# EAGLE design switch (EAGLE 7.5.0)

## Sheet 1 of 2
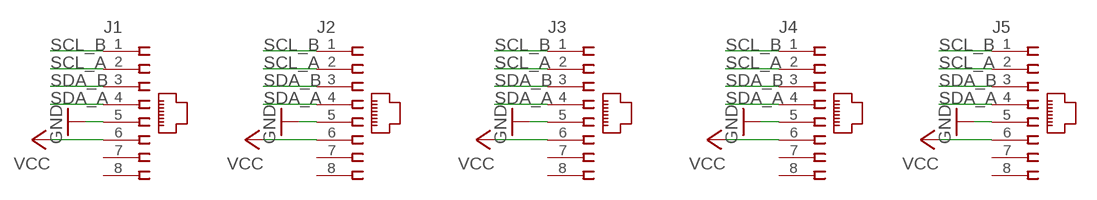
[diagram p0: schematic, sheet 1]

### Parts
J1  215877-4  [215877-4]
J2  215877-4  [215877-4]
J3  215877-4  [215877-4]
J4  215877-4  [215877-4]
J5  215877-4  [215877-4]

### Nets
GND: J1.5 J2.5 J3.5 J4.5 J5.5
SCL_A: J1.2 J2.2 J3.2 J4.2 J5.2
SCL_B: J1.1 J2.1 J3.1 J4.1 J5.1
SDA_A: J1.4 J2.4 J3.4 J4.4 J5.4
SDA_B: J1.3 J2.3 J3.3 J4.3 J5.3
VCC: J1.6 J2.6 J3.6 J4.6 J5.6
Unconnected: J1.7 J1.8 J2.7 J2.8 J3.7 J3.8 J4.7 J4.8 J5.7 J5.8

## Sheet 2 of 2

## Library data of the parts
J1-J5 = con-amp:215877-4: AMP connector

## Board
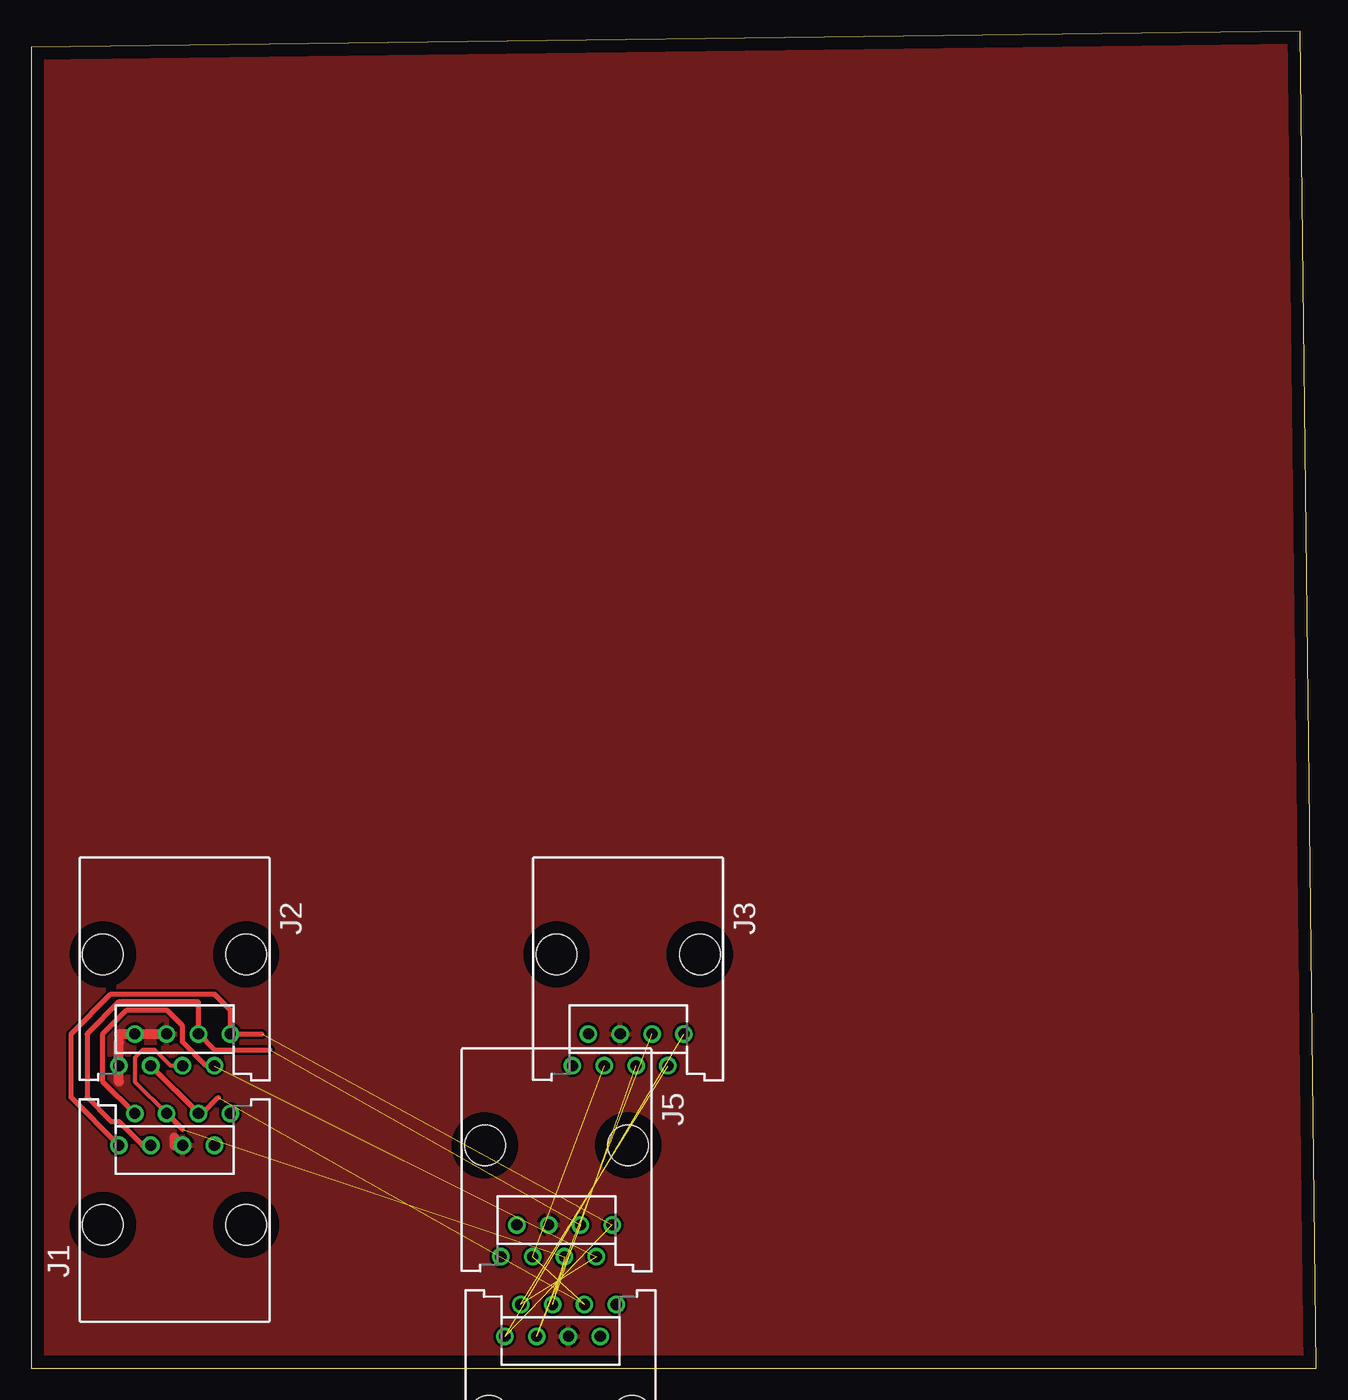
[diagram p1: board, top side]
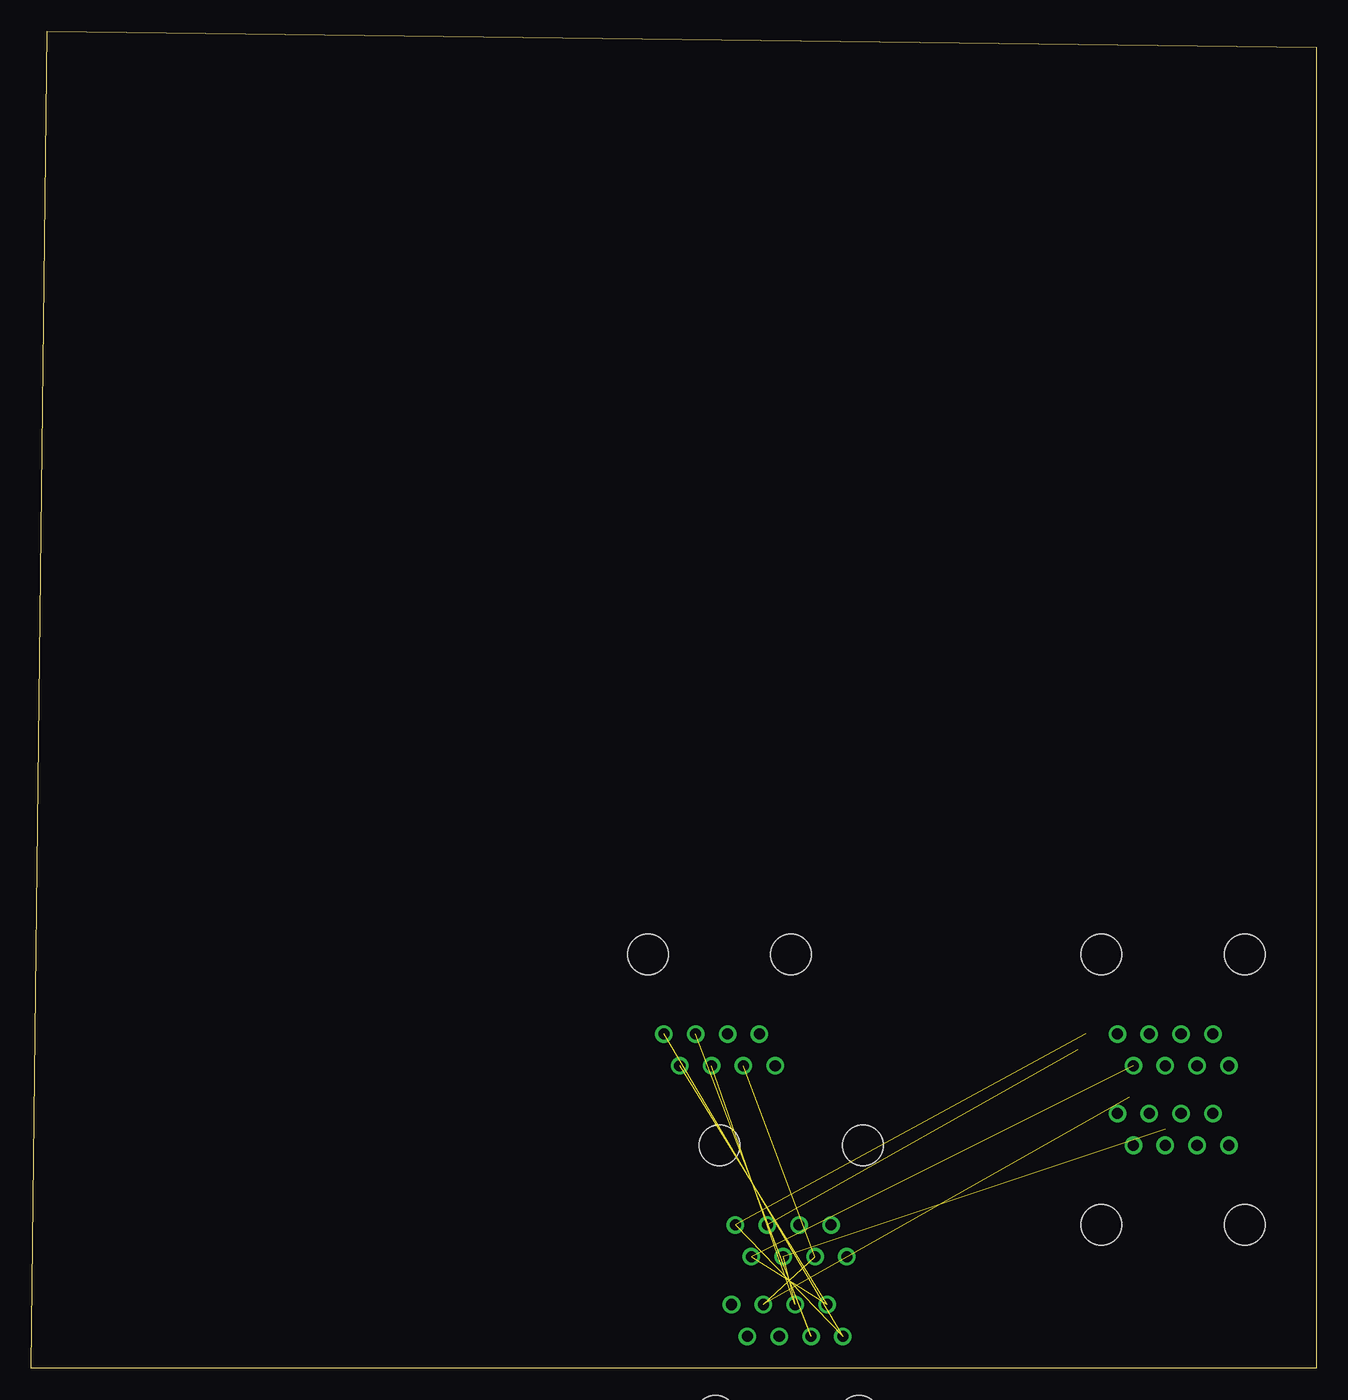
[diagram p2: board, bottom side, seen from below]

Size 102.54 x 106.67 mm. Coordinates in mm from the lower left corner, seen from the top.
Outline: 0,0 102.54,0 101.27,106.67 0,105.4 0,0
Copper layers (1*16): Top 0.035mm / dielectric 1.5mm / Bottom 0.035mm
Design rules "default": minimum track width 10mil, minimum drill 24mil, track to track 8mil, track to pad 8mil, pad to pad 8mil, via to via 8mil, smd to smd 8mil, copper to edge 40mil, drill to drill 8mil, minimum pad ring 10mil, minimum via ring 8mil, stop-mask expansion 4mil, vias tented up to drill 0mil, thermal gap 10mil

### Footprints (pad centres in the part's own frame; a part is rotated, then mirrored left to right if it is on the bottom)
215877-4 = drill 0.889: 1 -4.445,6.35; 2 -3.175,8.89; 3 -1.905,6.35; 4 -0.635,8.89; 5 0.635,6.35; 6 1.905,8.89; 7 3.175,6.35; 8 4.445,8.89 | hole 3.251: -5.715,0; 5.715,0

### Placement (x,y rotation side)
J1  11.43,11.43 0 top
J2  11.43,33.02 180 top
J3  47.62,33.02 180 top
J4  42.23,-3.81 0 top
J5  41.91,17.78 180 top

### Tracks (layer width: path | path; a pad name or v marks a point on that pad's centre or on a via)
GND
  Top 0.813: 6.99,22.86 6.99,26.04 | 6.99,26.67 J2.5 | J1.5 11.43,17.78 11.43,18.41
  pour Top: -15.24,-1.27 -15.24,124.46 107.95,124.46 107.95,-24.13 -15.24,-24.13
  pour Bottom: 141.6,117.47 255.91,120.02 255.91,-1.91 141.6,-1.91
SCL_A  (3 unrouted)
  Top 0.406: J1.2 5.71,22.86 5.71,26.67 7.62,28.57 10.79,28.57 12.06,27.3 12.06,26.04 13.97,24.13 J2.2
SCL_B  (3 unrouted)
  Top 0.406: J1.1 3.17,21.59 3.17,26.67 6.35,29.84 14.61,29.84 15.88,28.57 J2.1 18.41,26.67
SDA_A  (3 unrouted)
  Top 0.305: J2.4 11.11,24.13 9.84,25.4 8.89,25.4 8.26,24.77 8.26,22.86 J1.4
  Top 0.406: J1.4 12.06,19.05
SDA_B  (3 unrouted)
  Top 0.406: 19.05,25.4 14.61,25.4 J2.3 13.34,29.21 6.99,29.21 4.45,26.67 4.45,21.59 6.35,19.68 6.99,19.68 8.89,17.78 J1.3
VCC  (3 unrouted)
  Top 0.406: J2.6 J1.6 13.65,20.32 14.92,21.59